# EAGLE design Usbasp_Pdi (EAGLE 6.6.0)
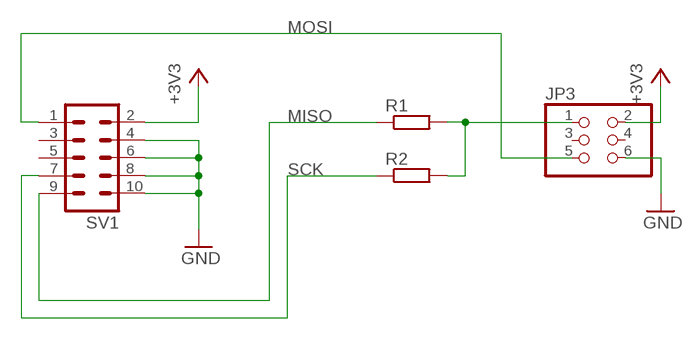
[diagram p0: schematic, sheet 1]

## Parts
JP3  PINHD-2X03_2.54  [2X03]
R1  R-EU_R0603  [R0603]
R2  R-EU_R0603  [R0603]
SV1  ML10  [ML10]

## Nets
+3V3: JP3.2 SV1.2
GND: JP3.6 SV1.4 SV1.6 SV1.8 SV1.10
MISO: R1.1 SV1.9
MOSI: JP3.5 SV1.1
N$2: JP3.1 R1.2 R2.2
SCK: R2.1 SV1.7
Unconnected: JP3.3 JP3.4 SV1.3 SV1.5

## Library data of the parts
JP3 = pinhead-2:PINHD-2X03: PIN HEADER
R1 R2 = rcl:R-EU_: RESISTOR, European symbol
SV1 = con-harting-ml:ML10: HARTING; OC_FARNELL: unknown; OC_NEWARK: unknown

## Board
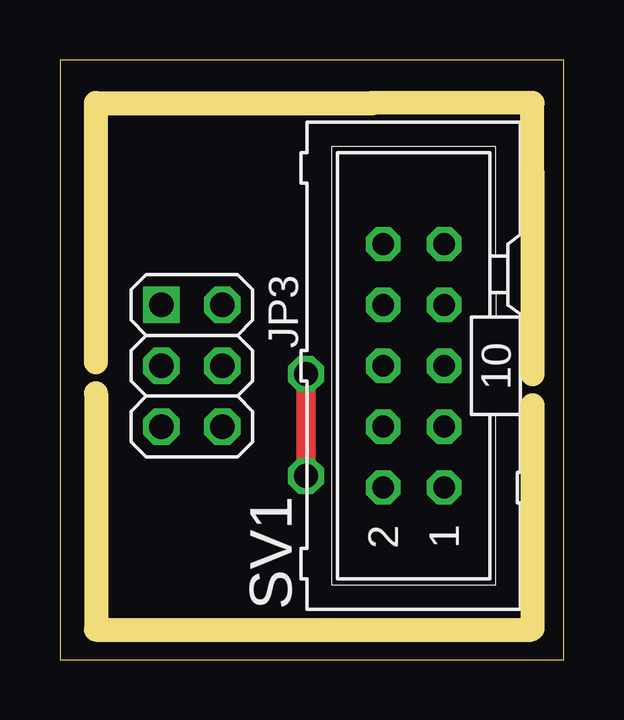
[diagram p1: board, top side]
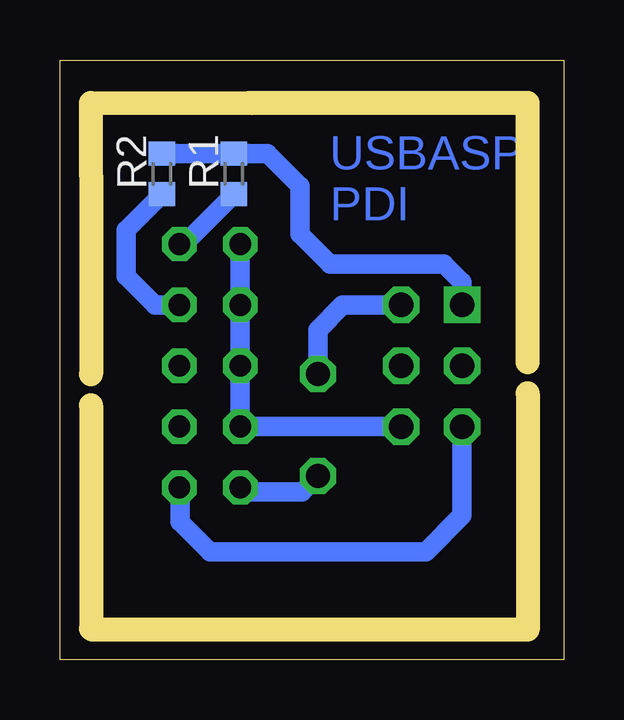
[diagram p2: board, bottom side, seen from below]

Size 21 x 25 mm. Coordinates in mm from the lower left corner, seen from the top.
Outline: 0,0 21,0 21,25 0,25 0,0
Copper layers (1*16): Top 0.035mm / dielectric 1.5mm / Bottom 0.035mm
Design rules "default": minimum track width 10mil, minimum drill 24mil, track to track 8mil, track to pad 8mil, pad to pad 8mil, via to via 8mil, smd to smd 8mil, copper to edge 40mil, drill to drill 8mil, minimum pad ring 10mil, minimum via ring 8mil, stop-mask expansion 4mil, vias tented up to drill 0mil, thermal gap 10mil
Milling: 10 lines

### Footprints (pad centres in the part's own frame; a part is rotated, then mirrored left to right if it is on the bottom)
2X03 = drill 1.016 square: 1 -2.54,-1.27 | drill 1.016 octagon: 2 -2.54,1.27; 3 0,-1.27; 4 0,1.27; 5 2.54,-1.27; 6 2.54,1.27
R0603 = smd 1 x 1.1: 1 -0.85,0; 2 0.85,0
ML10 = drill 0.914 octagon: 1 -5.08,-1.27; 2 -5.08,1.27; 3 -2.54,-1.27; 4 -2.54,1.27; 5 0,-1.27; 6 0,1.27; 7 2.54,-1.27; 8 2.54,1.27; 9 5.08,-1.27; 10 5.08,1.27

### Placement (x,y rotation side)
JP3  5.5,12.25 270 top
R1  13.75,20.25 90 bottom
R2  16.75,20.25 90 bottom
SV1  14.75,12.25 90 top

### Tracks (layer width: path | path; a pad name or v marks a point on that pad's centre or on a via)
+3V3  (via drill 1)
  Top 0.813: v10.25,11.9 v10.25,7.65
  Bottom 0.813: JP3.2 9.21,14.79 10.25,13.75 v10.25,11.9 | SV1.2 13.31,7 10.9,7 v10.25,7.65
GND
  Bottom 0.813: SV1.10 SV1.8 SV1.6 SV1.4 JP3.6
MISO
  Bottom 0.813: SV1.9 15.82,17.33 R1.1
MOSI
  Bottom 0.813: JP3.5 4.23,6.02 5.75,4.5 14.75,4.5 16,5.75 16,7.15 SV1.1
N$2
  Bottom 0.813: R2.2 R1.2 12.35,21.1 11,19.75 11,17.75 9.75,16.5 5,16.5 4.25,15.75 4.25,14.81 JP3.1
SCK
  Bottom 0.813: SV1.7 17.04,14.79 18.25,16 18.25,17.9 R2.1

### Text on the board
Bottom: USBASP / PDI